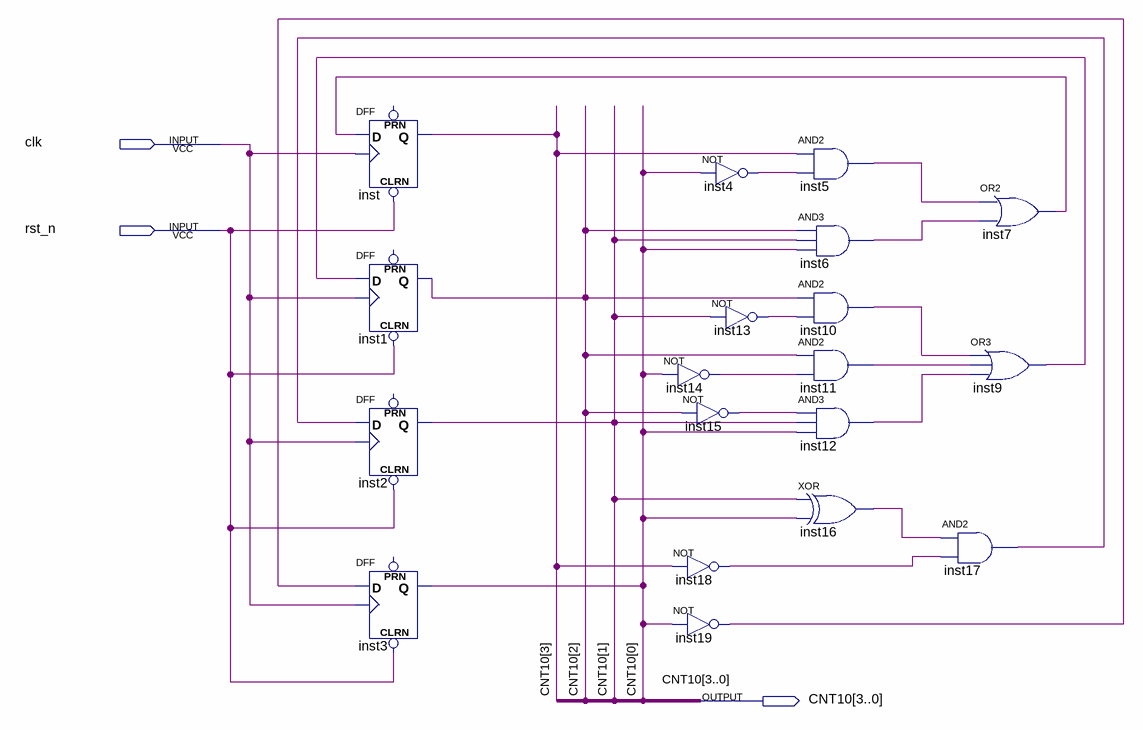
[diagram p0: schematic sheet]
// Quartus schematic CNT10.bdf as structural Verilog: 19 symbols, 3 pins
module CNT10 (
  input  clk,
  input  rst_n,
  output [3:0] CNT10
);

  wire inst4_out, inst5_out, inst6_out, inst7_out, inst9_out, inst10_out, inst11_out, inst12_out, inst13_out,
       inst14_out, inst15_out, inst16_out, inst17_out, inst18_out, inst19_out;

  DFF inst (.CLRN(rst_n), .CLK(clk), .D(inst7_out), .Q(CNT10[3]));  // open: PRN
  DFF inst1 (.CLRN(rst_n), .CLK(clk), .D(inst9_out), .Q(CNT10[2]));  // open: PRN
  DFF inst2 (.CLRN(rst_n), .CLK(clk), .D(inst17_out), .Q(CNT10[1]));  // open: PRN
  DFF inst3 (.CLRN(rst_n), .CLK(clk), .D(inst19_out), .Q(CNT10[0]));  // open: PRN
  not inst4 (inst4_out, CNT10[0]);
  not inst13 (inst13_out, CNT10[1]);
  not inst14 (inst14_out, CNT10[0]);
  not inst15 (inst15_out, CNT10[2]);
  not inst18 (inst18_out, CNT10[3]);
  not inst19 (inst19_out, CNT10[0]);
  and inst5 (inst5_out, CNT10[3], inst4_out);
  and inst6 (inst6_out, CNT10[2], CNT10[1], CNT10[0]);
  and inst10 (inst10_out, CNT10[2], inst13_out);
  and inst11 (inst11_out, CNT10[2], inst14_out);
  and inst12 (inst12_out, inst15_out, CNT10[1], CNT10[0]);
  xor inst16 (inst16_out, CNT10[1], CNT10[0]);
  and inst17 (inst17_out, inst16_out, inst18_out);
  or inst7 (inst7_out, inst5_out, inst6_out);
  or inst9 (inst9_out, inst10_out, inst11_out, inst12_out);
endmodule
